# Altium schematic sheet USB.SchDoc
size A; SheetNumber: 1; SheetTotal: 1
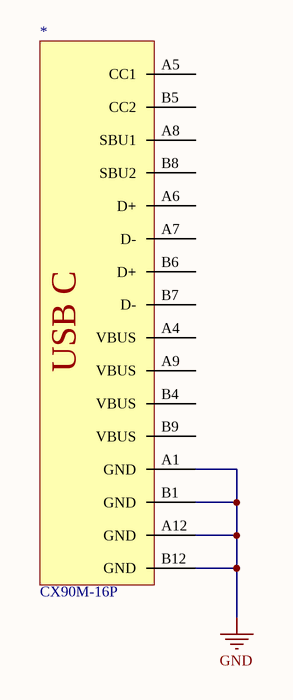
[diagram p0: USB.SchDoc]

## Parts
*  CX90M-16P

## Nets
GND: *.A1(GND) *.A12(GND) *.B1(GND) *.B12(GND)

Not connected (* = marked no-connect by the designer): * A4(VBUS) A5(CC1) A6(D+) A7(D-) A8(SBU1) A9(VBUS) B4(VBUS) B5(CC2) B6(D+) B7(D-) B8(SBU2) B9(VBUS)

## Notes on the sheet
- (in symbol CX90M-16P) USB C

## Library data of the parts
* = CX90M-16P: USB - C USB 3.0 (USB 3.1 Gen 1, Superspeed) Receptacle Connector 16 Position smt; Manufacturer: Hirose; Number of Contacts: 16; Number of Ports: 1; Current Rating: 1.25A; Mating Cycles: 10000; Shielding: Shielded; Supplier 1: Digi-Key; Manufacturer Part Number: CX90M-16P; RoHS: Yes; Category: USB Connectors; Stock 1: 51; Pricing 1: 1=2.35000, 10=2.13200, 25=2.00120, 50=1.91400, 100=1.82700, 250=1.65300, 500=1.52250 (USD); Mount: Surface Mount,Through Hole,Edge; Contact Plating: Gold; Insulation Color: Black; Min Operating Temperature: -30°C; Max Operating Temperature: 85°C; Connector Type: USB; Packaging: Cut Tape; Gender: Receptacle; Termination: Solder; Flammability Rating: UL94 V-0; ComponentLink1URL: https://www.hirose.com/product/download/?distributor=digikey&amp;type=2d&amp;lang=en&amp;num=CX90M-16P&src-supplier=Digi-Key; ComponentLink1Description: https://www.hirose.com/product/download/?distributor=digikey&amp;type=2d&amp;lang=en&amp;num=CX90M-16P&src-supplier=Digi-Key; Supplier Part Number 1: H126318CT-ND